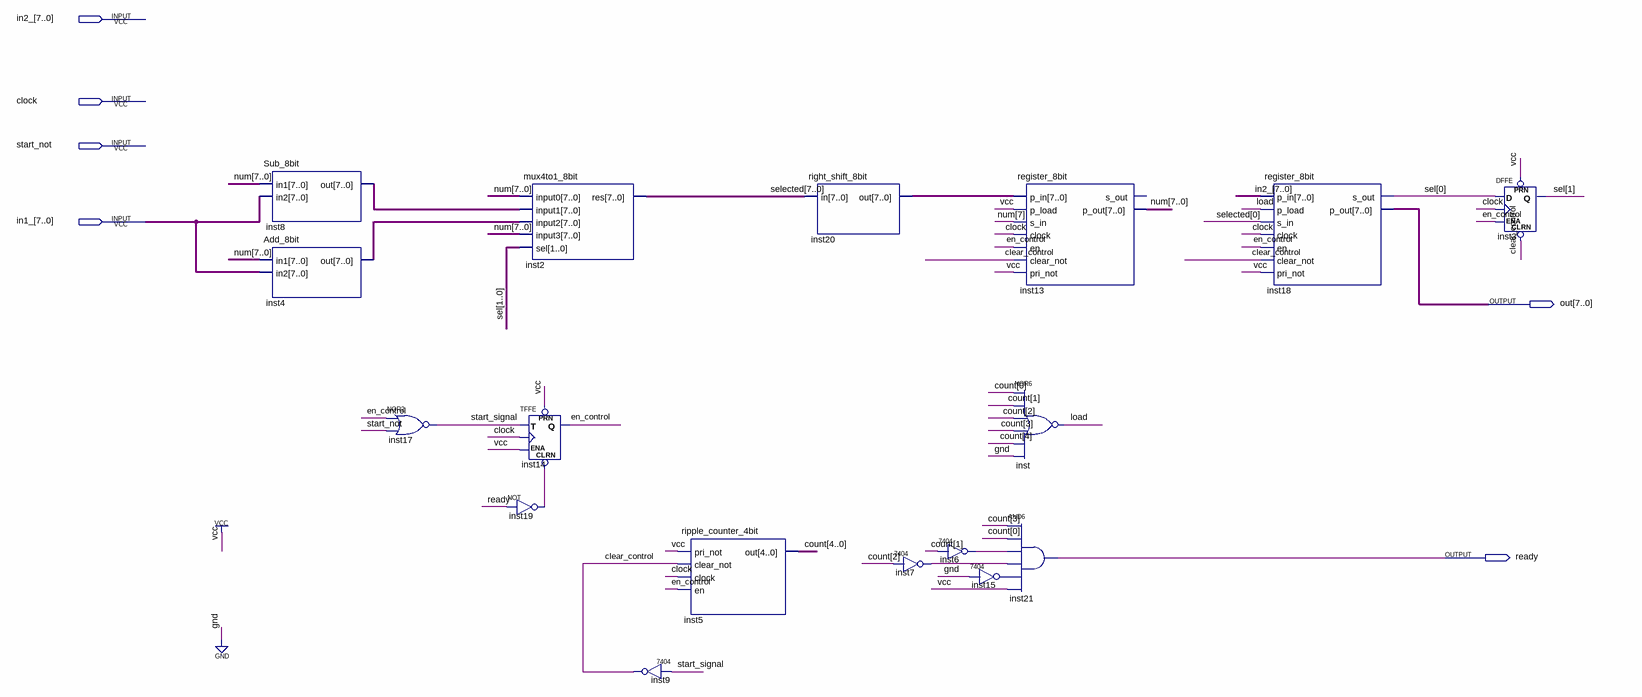
[diagram p0: schematic sheet]
// Quartus schematic booth_multiplier_8bit.bdf as structural Verilog: 17 symbols, 6 pins
module booth_multiplier_8bit (
  input  [7:0] in2_,
  input  clock,
  input  start_not,
  input  [7:0] in1_,
  output [7:0] out,
  output ready
);

  wire clear_control, en_control, inst6_1, inst7_1, inst15_1, inst19_out, load, start_signal;
  wire [1:0] sel;
  wire [4:0] count;
  wire [7:0] inst4_out, inst8_out, inst20_out, num, selected;

  Sub_8bit inst8 (.in1(num), .in2(in1_), .out(inst8_out));
  Add_8bit inst4 (.in1(num), .in2(in1_), .out(inst4_out));
  nor inst17 (start_signal, en_control, start_not);
  not inst19 (inst19_out, ready);
  mux4to1_8bit inst2 (.input0(num), .input1(inst8_out), .input2(inst4_out), .input3(num), .sel(sel), .res(selected));
  TFFE inst14 (.CLRN(inst19_out), .T(start_signal), .CLK(clock), .ENA(1'b1), .PRN(1'b1), .Q(en_control));
  \7404  inst9 (.\2 (start_signal), .\1 (clear_control));
  ripple_counter_4bit inst5 (.pri_not(1'b1), .clear_not(clear_control), .clock(clock), .en(en_control), .out(count));
  right_shift_8bit inst20 (.in(selected), .out(inst20_out));
  \7404  inst7 (.\2 (count[2]), .\1 (inst7_1));
  \7404  inst6 (.\2 (count[1]), .\1 (inst6_1));
  \7404  inst15 (.\2 (1'b0), .\1 (inst15_1));
  register_8bit inst13 (
    .p_in(inst20_out), .p_load(1'b1), .s_in(num[7]), .clock(clock), .en(en_control),
    .clear_not(clear_control), .pri_not(1'b1), .p_out(num));  // open: s_out
  nor inst (load, count[0], count[1], count[2], count[3], count[4], 1'b0);
  and inst21 (ready, count[3], count[0], inst6_1, inst7_1, inst15_1, 1'b1);
  register_8bit inst18 (
    .p_in(in2_), .p_load(load), .s_in(selected[0]), .clock(clock), .en(en_control),
    .clear_not(clear_control), .pri_not(1'b1), .s_out(sel[0]), .p_out(out));
  DFFE inst3 (.PRN(1'b1), .CLRN(clear_control), .D(sel[0]), .CLK(clock), .ENA(en_control), .Q(sel[1]));
endmodule
